# Altium project BOARD_MASTER_MAGANG.PrjPcb
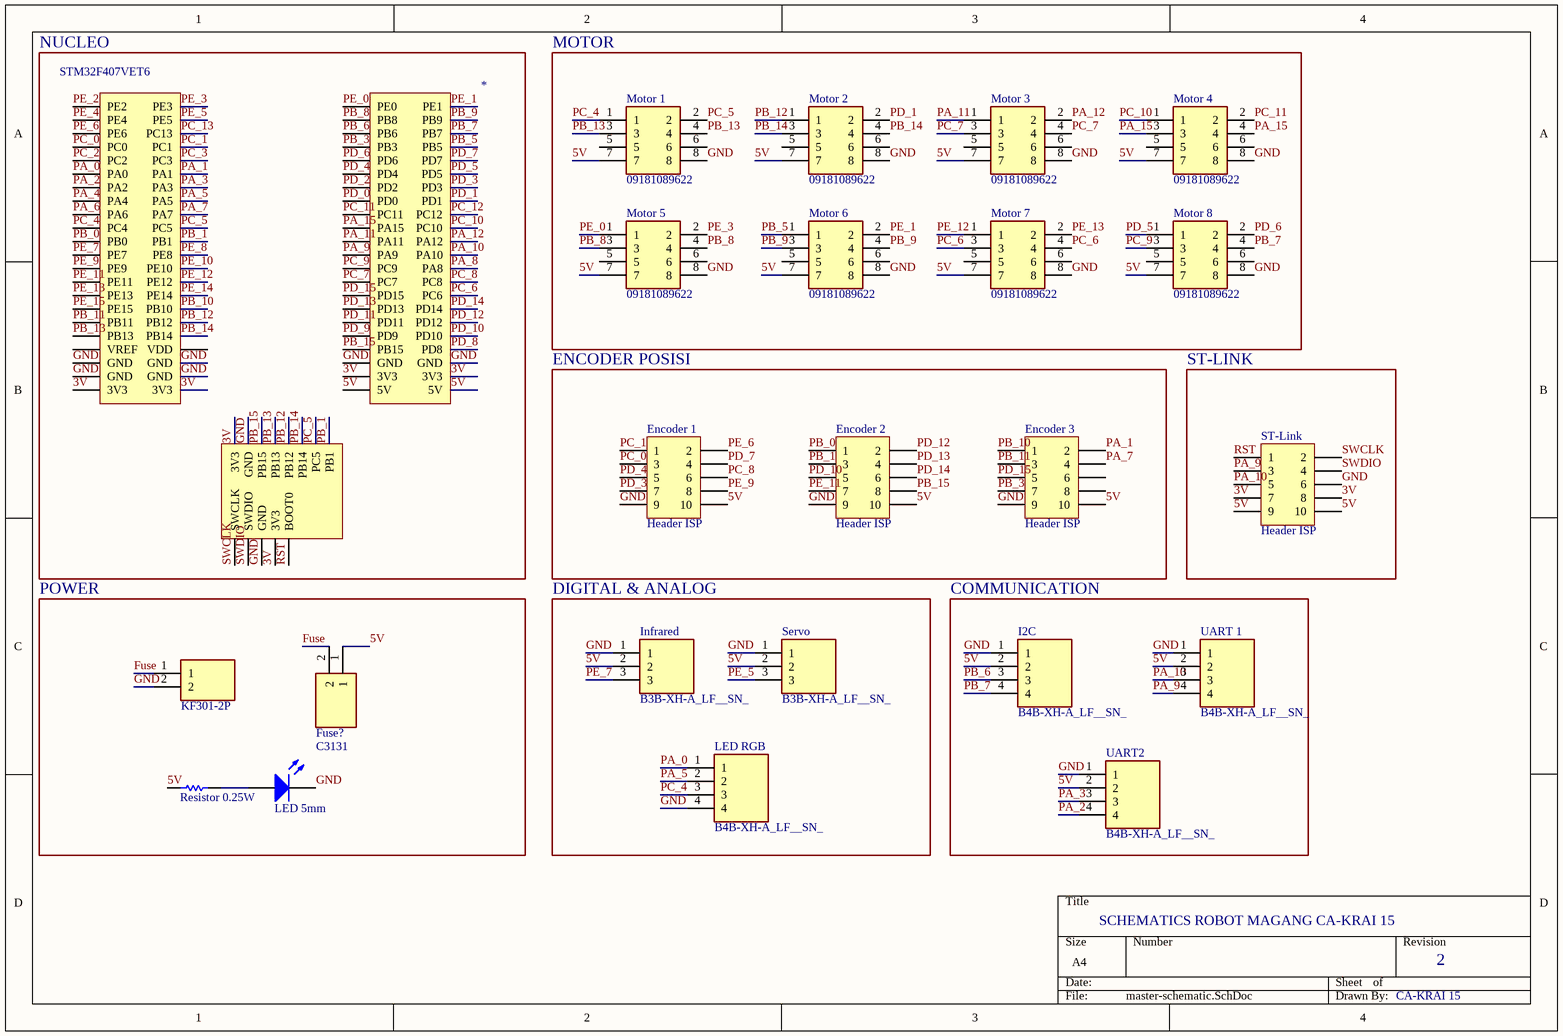
[diagram p0: master-schematic.SchDoc]
1 sheet, 23 parts. Net scope: global (net labels, ports and power ports of the same name join across sheets).
Board file: master-schematic-gs.PcbDoc

## Sheet master-schematic.SchDoc
size A4; SheetNumber: 1; SheetTotal: 1

### Parts
Encoder_1  Header ISP  [Header ISP]
Encoder_2  Header ISP  [Header ISP]
Encoder_3  Header ISP  [Header ISP]
Fuse  C3131  [C3131]
I2C  B4B-XH-A_LF__SN_  [B4BXHALFSN]
Infrared  B3B-XH-A_LF__SN_  [B3BXHALFSN]
LED  LED 5mm  [LED 5mm]
LED_RGB  B4B-XH-A_LF__SN_  [B4BXHALFSN]
Motor_1  09181089622  [09181089622]
Motor_2  09181089622  [09181089622]
Motor_3  09181089622  [09181089622]
Motor_4  09181089622  [09181089622]
Motor_5  09181089622  [09181089622]
Motor_6  09181089622  [09181089622]
Motor_7  09181089622  [09181089622]
Motor_8  09181089622  [09181089622]
Power?  KF301-2P  [KF3012P]
R  Resistor 0.25W  [Resistor 0.25W]
Servo  B3B-XH-A_LF__SN_  [B3BXHALFSN]
ST-Link  Header ISP  [Header ISP]
STM32_F407VET6  STM32F407VET6  [MICON]
UART2  B4B-XH-A_LF__SN_  [B4BXHALFSN]
UART_1  B4B-XH-A_LF__SN_  [B4BXHALFSN]

### Blocks framed on the sheet
NUCLEO: STM32_F407VET6
MOTOR: Motor_1-Motor_8
ENCODER POSISI: Encoder_1-Encoder_3
ST-LINK: ST-Link
POWER: Fuse LED Power? R
DIGITAL & ANALOG: Infrared LED_RGB Servo
COMMUNICATION: I2C UART2 UART_1

### Nets
3V: ST-Link.7 ST-Link.8 STM32_F407VET6.3V3
5V: Encoder_1.10 Encoder_2.10 Encoder_3.10 Fuse.1 I2C.2 Infrared.2 Motor_1.7 Motor_2.7 Motor_3.7 Motor_4.7 Motor_5.7 Motor_6.7 Motor_7.7 Motor_8.7 R.1 Servo.2 ST-Link.9 ST-Link.10 STM32_F407VET6.5V UART2.2 UART_1.2
Fuse: Fuse.2 Power?.1
GND: Encoder_1.9 Encoder_2.9 Encoder_3.9 I2C.1 Infrared.1 LED.2(K) LED_RGB.4 Motor_1.8 Motor_2.8 Motor_3.8 Motor_4.8 Motor_5.8 Motor_6.8 Motor_7.8 Motor_8.8 Power?.2 Servo.1 ST-Link.6 STM32_F407VET6.GND UART2.1 UART_1.1
PA_0: LED_RGB.1 STM32_F407VET6.PA0
PA_1: Encoder_3.2 STM32_F407VET6.PA1
PA_2: STM32_F407VET6.PA2 UART2.4
PA_3: STM32_F407VET6.PA3 UART2.3
PA_4: STM32_F407VET6.PA4
PA_5: LED_RGB.2 STM32_F407VET6.PA5
PA_6: STM32_F407VET6.PA6
PA_7: Encoder_3.4 STM32_F407VET6.PA7
PA_8: STM32_F407VET6.PA8
PA_9: ST-Link.3 STM32_F407VET6.PA9 UART_1.4
PA_10: ST-Link.5 STM32_F407VET6.PA10 UART_1.3
PA_11: Motor_3.1 STM32_F407VET6.PA11
PA_12: Motor_3.2 STM32_F407VET6.PA12
PA_15: Motor_4.3 Motor_4.4 STM32_F407VET6.PA15
PB_0: Encoder_2.1 STM32_F407VET6.PB0
PB_1: Encoder_2.3 STM32_F407VET6.PB1
PB_3: Encoder_3.7 STM32_F407VET6.PB3
PB_5: Motor_6.1 STM32_F407VET6.PB5
PB_6: I2C.3 STM32_F407VET6.PB6
PB_7: I2C.4 Motor_8.4 STM32_F407VET6.PB7
PB_8: Motor_5.3 Motor_5.4 STM32_F407VET6.PB8
PB_9: Motor_6.3 Motor_6.4 STM32_F407VET6.PB9
PB_10: Encoder_3.1 STM32_F407VET6.PB10
PB_11: Encoder_3.3 STM32_F407VET6.PB11
PB_12: Motor_2.1 STM32_F407VET6.PB12
PB_13: Motor_1.3 Motor_1.4 STM32_F407VET6.PB13
PB_14: Motor_2.3 Motor_2.4 STM32_F407VET6.PB14
PB_15: Encoder_2.8 STM32_F407VET6.PB15
PC_0: Encoder_1.3 STM32_F407VET6.PC0
PC_1: Encoder_1.1 STM32_F407VET6.PC1
PC_2: STM32_F407VET6.PC2
PC_3: STM32_F407VET6.PC3
PC_4: LED_RGB.3 Motor_1.1 STM32_F407VET6.PC4
PC_5: Motor_1.2 STM32_F407VET6.PC5
PC_6: Motor_7.3 Motor_7.4 STM32_F407VET6.PC6
PC_7: Motor_3.3 Motor_3.4 STM32_F407VET6.PC7
PC_8: Encoder_1.6 STM32_F407VET6.PC8
PC_9: Motor_8.3 STM32_F407VET6.PC9
PC_10: Motor_4.1 STM32_F407VET6.PC10
PC_11: Motor_4.2 STM32_F407VET6.PC11
PC_12: STM32_F407VET6.PC12
PC_13: STM32_F407VET6.PC13
PD_0: STM32_F407VET6.PD0
PD_1: Motor_2.2 STM32_F407VET6.PD1
PD_2: STM32_F407VET6.PD2
PD_3: Encoder_1.7 STM32_F407VET6.PD3
PD_4: Encoder_1.5 STM32_F407VET6.PD4
PD_5: Motor_8.1 STM32_F407VET6.PD5
PD_6: Motor_8.2 STM32_F407VET6.PD6
PD_7: Encoder_1.4 STM32_F407VET6.PD7
PD_8: STM32_F407VET6.PD8
PD_9: STM32_F407VET6.PD9
PD_10: Encoder_2.5 STM32_F407VET6.PD10
PD_11: STM32_F407VET6.PD11
PD_12: Encoder_2.2 STM32_F407VET6.PD12
PD_13: Encoder_2.4 STM32_F407VET6.PD13
PD_14: Encoder_2.6 STM32_F407VET6.PD14
PD_15: Encoder_3.5 STM32_F407VET6.PD15
PE_0: Motor_5.1 STM32_F407VET6.PE0
PE_1: Motor_6.2 STM32_F407VET6.PE1
PE_2: STM32_F407VET6.PE2
PE_3: Motor_5.2 STM32_F407VET6.PE3
PE_4: STM32_F407VET6.PE4
PE_5: Servo.3 STM32_F407VET6.PE5
PE_6: Encoder_1.2 STM32_F407VET6.PE6
PE_7: Infrared.3 STM32_F407VET6.PE7
PE_8: STM32_F407VET6.PE8
PE_9: Encoder_1.8 STM32_F407VET6.PE9
PE_10: STM32_F407VET6.PE10
PE_11: Encoder_2.7 STM32_F407VET6.PE11
PE_12: Motor_7.1 STM32_F407VET6.PE12
PE_13: Motor_7.2 STM32_F407VET6.PE13
PE_14: STM32_F407VET6.PE14
PE_15: STM32_F407VET6.PE15
RST: ST-Link.1 STM32_F407VET6.BOOT0
SWCLK: ST-Link.2 STM32_F407VET6.SWCLK
SWDIO: ST-Link.4 STM32_F407VET6.SWDIO
NetLED_1: LED.1(A) R.2

Not connected (* = marked no-connect by the designer): Encoder_3 6 8; Motor_1 5 6; Motor_2 5 6; Motor_3 5 6; Motor_4 5 6; Motor_5 5 6; Motor_6 5 6; Motor_7 5 6; Motor_8 5 6; STM32_F407VET6 VDD VREF

### Notes on the sheet
- SCHEMATICS ROBOT MAGANG CA-KRAI 15
- 2
- CA-KRAI 15

### Library data of the parts
Encoder_1 Encoder_3 = Header ISP: Encoder Posisi X
Encoder_2 = Header ISP: Encoder Posisi Y
Fuse = C3131: Undefined or Miscellaneous; Manufacturer_Name: Xucheng Elec; Datasheet Link: https://datasheet.lcsc.com/szlcsc/XC-Elec-Shenzhen-5x20-BLX-Fuse-holder_C3131.pdf; Height: 10.5mm; Manufacturer_Part_Number: C3131
I2C LED_RGB UART2 UART_1 = B4B-XH-A_LF__SN_: Connector; Manufacturer_Name: JST (JAPAN SOLDERLESS TERMINALS); Manufacturer_Part_Number: B4B-XH-A(LF)(SN); Datasheet Link: https://datasheet.lcsc.com/szlcsc/JST-Sales-America-B4B-XH-A-LF-SN_C144395.pdf; Height: 7mm; Arrow Part Number: B4B-XH-A(LF)(SN); Arrow Price/Stock: https://www.arrow.com/en/products/b4b-xh-a-lf-sn/jst-manufacturing
Infrared = B3B-XH-A_LF__SN_: Connector; Manufacturer_Name: JST (JAPAN SOLDERLESS TERMINALS); Manufacturer_Part_Number: B3B-XH-A(LF)(SN); Datasheet Link: https://datasheet.lcsc.com/szlcsc/1812131720_JST-Sales-America-B3B-XH-A-LF-SN_C144394.pdf; Height: 7mm; Arrow Part Number: B3B-XH-A(LF)(SN); Arrow Price/Stock: https://www.arrow.com/en/products/b3b-xh-a-lf-sn/jst-manufacturing?region=europe
Motor_1-Motor_8 = 09181089622: Connector; Manufacturer_Name: HARTING; Datasheet Link: http://uk.rs-online.com/web/p/products/6935182; Height: 5.5mm; Manufacturer_Part_Number: 09181089622; Mouser Part Number: 617-09181089622; Mouser Price/Stock: https://www.mouser.co.uk/ProductDetail/HARTING/09181089622?qs=FeiuqfHlVTv2CjJEejdN9Q%3D%3D
Power? = KF301-2P: Connector; Manufacturer_Name: Handson Technology; Datasheet Link: http://www.handsontec.com/dataspecs/terminal%20block-5mm.pdf; Height: 10mm; Manufacturer_Part_Number: KF301-2P
Servo = B3B-XH-A_LF__SN_: Servo pin; Manufacturer_Name: JST (JAPAN SOLDERLESS TERMINALS); Manufacturer_Part_Number: B3B-XH-A(LF)(SN); Datasheet Link: https://datasheet.lcsc.com/szlcsc/1812131720_JST-Sales-America-B3B-XH-A-LF-SN_C144394.pdf; Height: 7mm; Arrow Part Number: B3B-XH-A(LF)(SN); Arrow Price/Stock: https://www.arrow.com/en/products/b3b-xh-a-lf-sn/jst-manufacturing?region=europe
ST-Link = Header ISP: ST-Link Port
STM32_F407VET6 = Micon?